# EAGLE design C64-usb-loader (EAGLE 6.5.0)
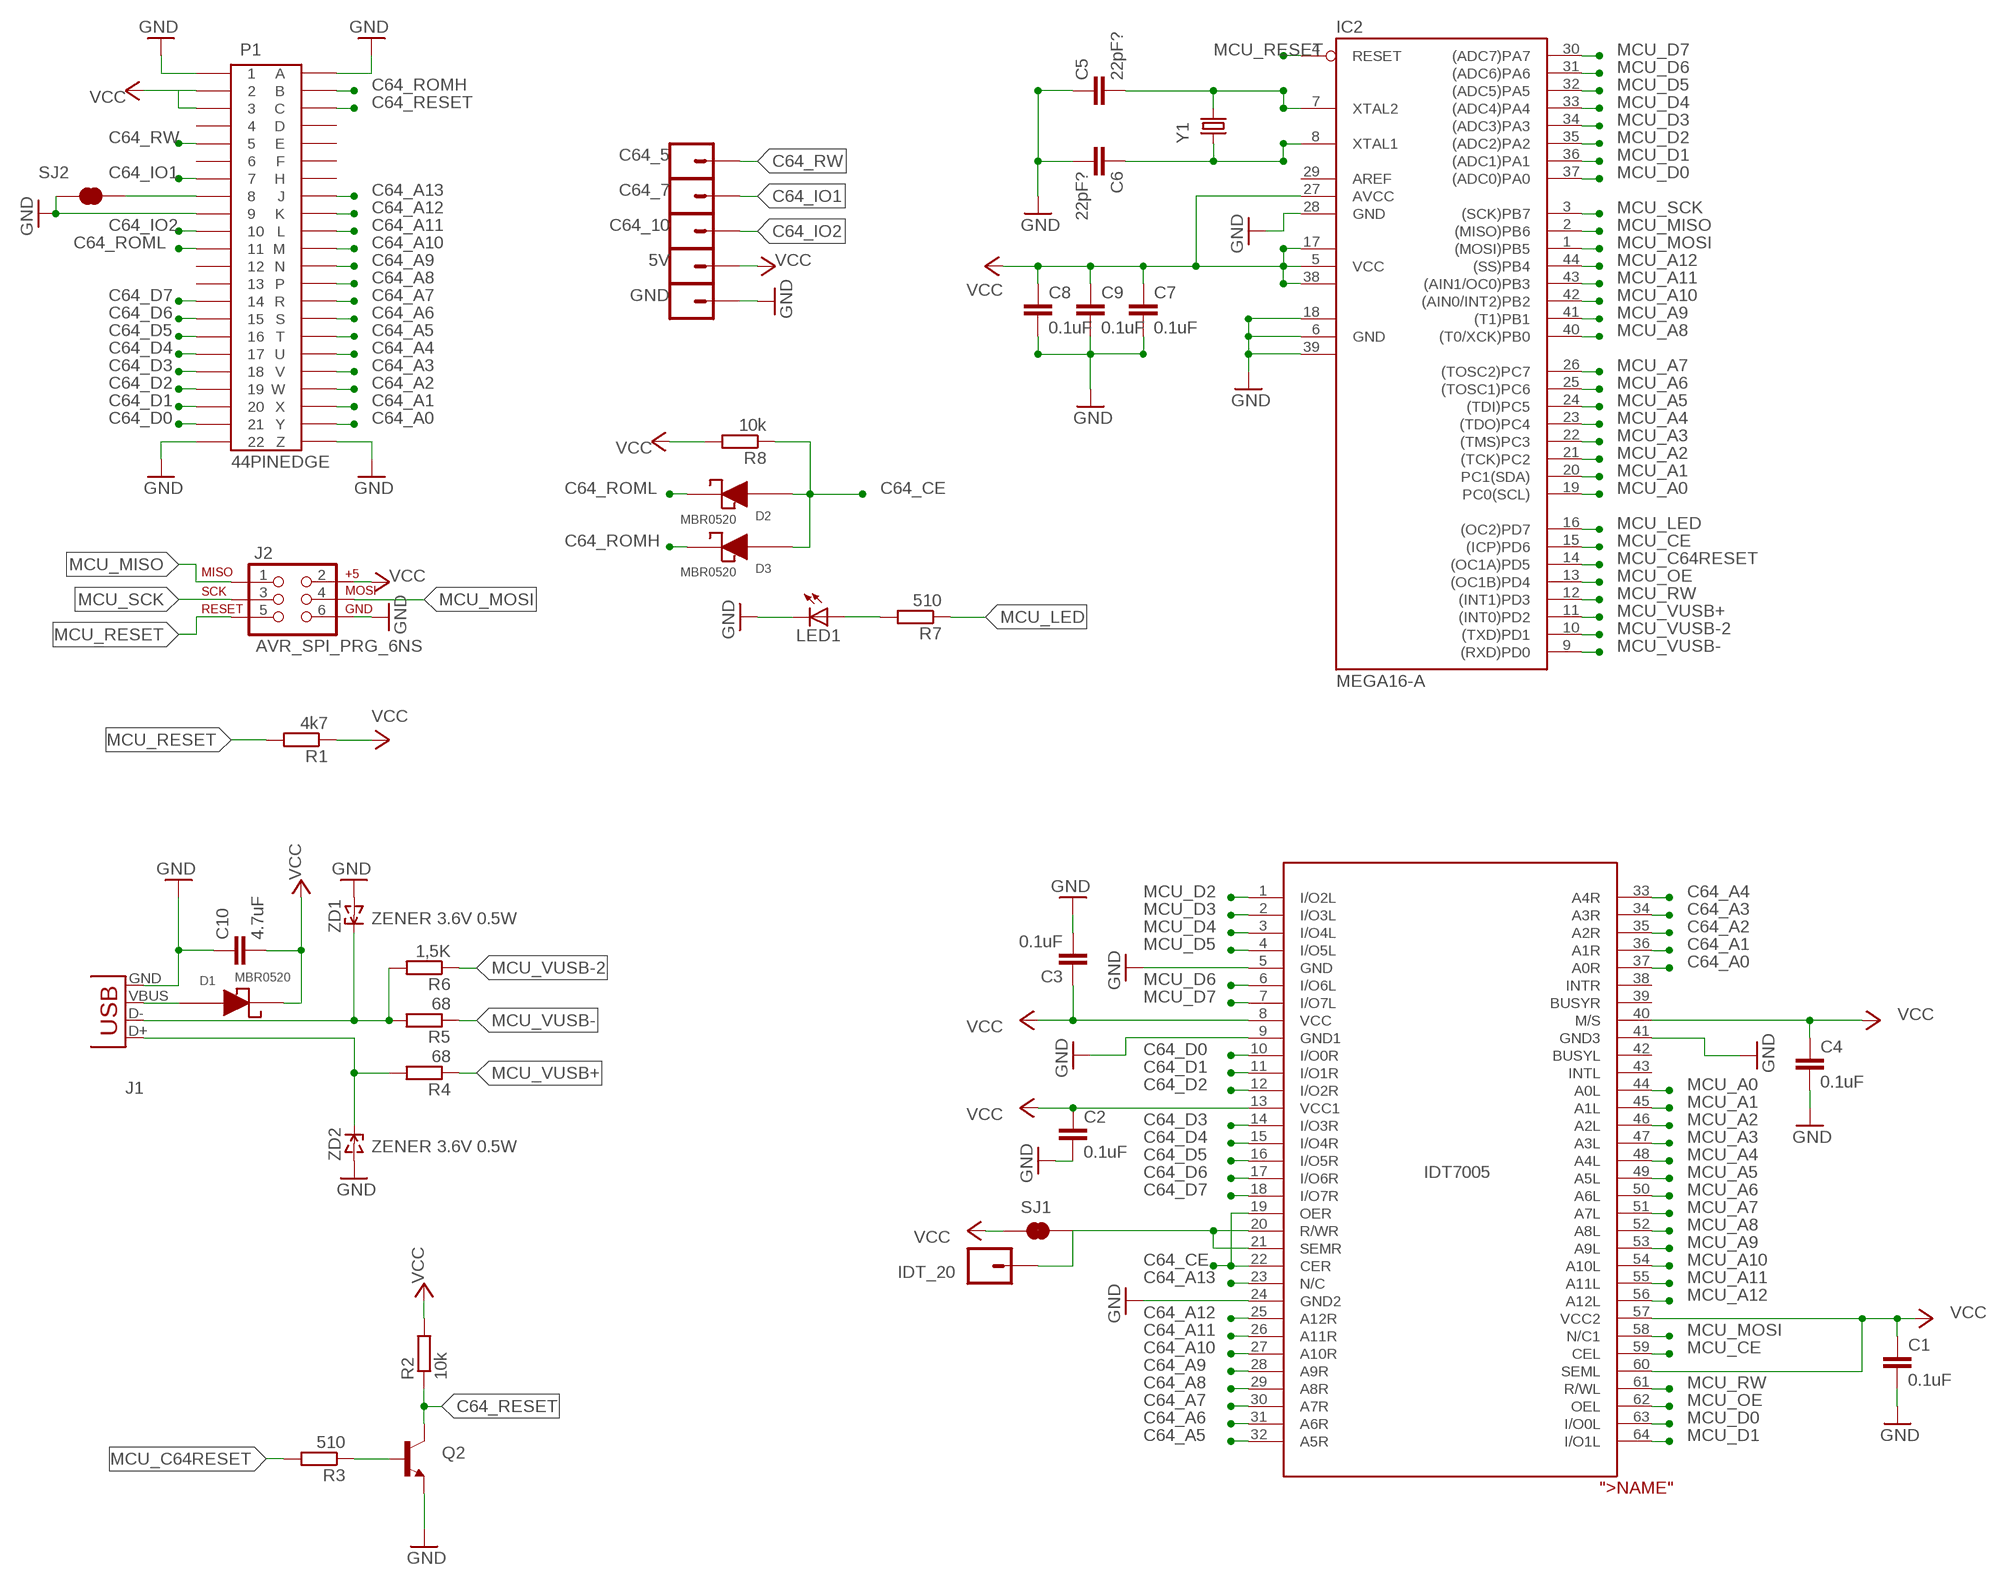
[diagram p0: schematic, sheet 1]

## Parts
5V  M01PTH  [1X01]
C1  0.1uF  C-EUC0805  [C0805]
C2  0.1uF  C-EUC0805  [C0805]
C3  0.1uF  C-EUC0805  [C0805]
C4  0.1uF  C-EUC0805  [C0805]
C5  22pF?  C-EUC0805  [C0805]
C6  22pF?  C-EUC0805  [C0805]
C7  0.1uF  C-EUC0805  [C0805]
C8  0.1uF  C-EUC0805  [C0805]
C9  0.1uF  C-EUC0805  [C0805]
C10  4.7uF  C-EUC0805  [C0805]
C64_5  M01PTH  [1X01]
C64_7  M01PTH  [1X01]
C64_10  M01PTH  [1X01]
D1  MBR0520  [SOD-123]
D2  MBR0520  [SOD-123]
D3  MBR0520  [SOD-123]
GND  M01PTH  [1X01]
IC1  IDT7005  [TQFP64]
IC2  MEGA16-A  [TQFP44]
IDT_20  M01PTH  [1X01]
J1  USB-B  [B]
J2  AVR_SPI_PRG_6NS  [2X3-NS]
LED1  LED1206  [LED-1206]
P1  44PINEDGE  [44PINEDGE]
Q2  TRANSISTOR_NPNSOT23-3  [SOT23-3]
R1  4k7  R-EU_M0805  [M0805]
R2  10k  R-EU_M0805  [M0805]
R3  510  R-EU_M0805  [M0805]
R4  68  R-EU_M0805  [M0805]
R5  68  R-EU_M0805  [M0805]
R6  1,5K  R-EU_M0805  [M0805]
R7  510  R-EU_M0805  [M0805]
R8  10k  R-EU_M0805  [M0805]
SJ1  JUMPER-PAD-2-NC_BY_TRACE  [PAD-JUMPER-2-NC_BY_TRACE_YES_SILK]
SJ2  JUMPER-PAD-2-NC_BY_TRACE  [PAD-JUMPER-2-NC_BY_TRACE_YES_SILK]
Y1  CRYSTALHC49US  [HC49US]
ZD1  ZENER 3.6V 0.5W  ZENERSOD-123  [SOD-123]
ZD2  ZENER 3.6V 0.5W  ZENERSOD-123  [SOD-123]

## Nets
C64_A0: IC1.37(A0R) P1.Y
C64_A1: IC1.36(A1R) P1.X
C64_A2: IC1.35(A2R) P1.W
C64_A3: IC1.34(A3R) P1.V
C64_A4: IC1.33(A4R) P1.U
C64_A5: IC1.32(A5R) P1.T
C64_A6: IC1.31(A6R) P1.S
C64_A7: IC1.30(A7R) P1.R
C64_A8: IC1.29(A8R) P1.P
C64_A9: IC1.28(A9R) P1.N
C64_A10: IC1.27(A10R) P1.M
C64_A11: IC1.26(A11R) P1.L
C64_A12: IC1.25(A12R) P1.K
C64_A13: IC1.23(N/C) P1.J
C64_CE: D2.2(AN) D3.2(AN) IC1.19(OER) IC1.22(CER) R8.1
C64_D0: IC1.10(I/O0R) P1.21
C64_D1: IC1.11(I/O1R) P1.20
C64_D2: IC1.12(I/O2R) P1.19
C64_D3: IC1.14(I/O3R) P1.18
C64_D4: IC1.15(I/O4R) P1.17
C64_D5: IC1.16(I/O5R) P1.16
C64_D6: IC1.17(I/O6R) P1.15
C64_D7: IC1.18(I/O7R) P1.14
C64_GAME: P1.8 SJ2.2
C64_IO1: C64_7.1 P1.7
C64_IO2: C64_10.1 P1.10
C64_RESET: P1.C Q2.3(C) R2.1
C64_ROMH: D3.1(CA) P1.B
C64_ROML: D2.1(CA) P1.11
C64_RW: C64_5.1 P1.5
D+: J1.D+ R4.2 ZD2.C
D-: J1.D- R5.2 R6.2 ZD1.C
GND: C1.2 C2.2 C3.2 C4.2 C5.1 C6.2 C7.2 C8.2 C9.2 C10.1 GND.1 IC1.5(GND) IC1.9(GND1) IC1.24(GND2) IC1.41(GND3) IC2.6(GND) IC2.18(GND1) IC2.28(GND) IC2.39(GND2) J1.GND J2.6 LED1.C P1.1 P1.9 P1.22 P1.A P1.Z Q2.2(E) SJ2.1 ZD1.A ZD2.A
MCU_A0: IC1.44(A0L) IC2.19(PC0(SCL))
MCU_A1: IC1.45(A1L) IC2.20(PC1(SDA))
MCU_A2: IC1.46(A2L) IC2.21((TCK)PC2)
MCU_A3: IC1.47(A3L) IC2.22((TMS)PC3)
MCU_A4: IC1.48(A4L) IC2.23((TDO)PC4)
MCU_A5: IC1.49(A5L) IC2.24((TDI)PC5)
MCU_A6: IC1.50(A6L) IC2.25((TOSC1)PC6)
MCU_A7: IC1.51(A7L) IC2.26((TOSC2)PC7)
MCU_A8: IC1.52(A8L) IC2.40((T0/XCK)PB0)
MCU_A9: IC1.53(A9L) IC2.41((T1)PB1)
MCU_A10: IC1.54(A10L) IC2.42((AIN0/INT2)PB2)
MCU_A11: IC1.55(A11L) IC2.43((AIN1/OC0)PB3)
MCU_A12: IC1.56(A12L) IC2.44((SS)PB4)
MCU_C64RESET: IC2.14((OC1A)PD5) R3.2
MCU_CE: IC1.59(CEL) IC2.15((ICP)PD6)
MCU_D0: IC1.63(I/O0L) IC2.37((ADC0)PA0)
MCU_D1: IC1.64(I/O1L) IC2.36((ADC1)PA1)
MCU_D2: IC1.1(I/O2L) IC2.35((ADC2)PA2)
MCU_D3: IC1.2(I/O3L) IC2.34((ADC3)PA3)
MCU_D4: IC1.3(I/O4L) IC2.33((ADC4)PA4)
MCU_D5: IC1.4(I/O5L) IC2.32((ADC5)PA5)
MCU_D6: IC1.6(I/O6L) IC2.31((ADC6)PA6)
MCU_D7: IC1.7(I/O7L) IC2.30((ADC7)PA7)
MCU_LED: IC2.16((OC2)PD7) R7.1
MCU_MISO: IC2.2((MISO)PB6) J2.1
MCU_MOSI: IC1.58(N/C1) IC2.1((MOSI)PB5) J2.4
MCU_OE: IC1.62(OEL) IC2.13((OC1B)PD4)
MCU_RESET: IC2.4(RESET) J2.5 R1.2
MCU_RW: IC1.61(R/WL) IC2.12((INT1)PD3)
MCU_SCK: IC2.3((SCK)PB7) J2.3
MCU_VUSB+: IC2.11((INT0)PD2) R4.1
MCU_VUSB-: IC2.9((RXD)PD0) R5.1
MCU_VUSB-2: IC2.10((TXD)PD1) R6.1
N$1: Q2.1(B) R3.1
N$3: C5.2 IC2.7(XTAL2) Y1.2
N$4: IC1.20(R/WR) IC1.21(SEMR) IDT_20.1 SJ1.2
N$5: C6.1 IC2.8(XTAL1) Y1.1
N$8: LED1.A R7.2
VBUS: D1.2(AN) J1.VBUS
VCC: 5V.1 C1.1 C2.1 C3.1 C4.1 C7.1 C8.1 C9.1 C10.2 D1.1(CA) IC1.8(VCC) IC1.13(VCC1) IC1.40(M/S) IC1.57(VCC2) IC1.60(SEML) IC2.5(VCC) IC2.17(VCC1) IC2.27(AVCC) IC2.38(VCC2) J2.2 P1.2 P1.3 R1.1 R2.2 R8.2 SJ1.1
Unconnected: IC1.38(INTR) IC1.39(BUSYR) IC1.42(BUSYL) IC1.43(INTL) IC2.29(AREF) P1.4 P1.6 P1.12 P1.13 P1.D P1.E P1.F P1.H

## Library data of the parts
5V C64_5 C64_7 C64_10 GND IDT_20 = SparkFun-Connectors:M01: Header 1 Standard 1-pin 0.1" header. Use with straight break away headers (SKU : PRT-00116), right angle break away headers (PRT-00553), swiss pins (PRT-00743), machine pins (PRT-00117), and female headers (PRT-00115).
C1-C10 = rcl:C-EU: CAPACITOR, European symbol
D1-D3 = Arduino Nano2:MBR0520; DIGIKEY: MBR0520LCT-ND
IC1 = IDT7005:IDT7005; DIGIKEY: 800-1357-5-ND ??
IC2 = atmel:MEGA16: MICROCONTROLLER 16 Kbytes FLASH 1 kbytes SRAM 512 bytes EEPROM USART 8-channel 10 bit ADC Source: avr.lbr; DIGIKEY: ATMEGA16A-AURCT-ND ??; MPN: ATMEGA16-16AU; OC_FARNELL: 9171134; OC_NEWARK: 96K6515
J1 = Connector:USB: USB Connectors USB-B-PTH is fully proven SKU : PRT-00139 USB-miniB is fully proven SKU : PRT-00587 USB-A-PCB is untested. USB-A-H is throughly reviewed, but untested. Spark Fun Electronics SKU : PRT-00437 USB-B-SMT is throughly reviewed, but untested. Needs silkscreen touching up. USB-A-S has not been used/tested USB-MB-H has not been used/tested; DIGIKEY: ED2983-ND ??
J2 = SparkFun-Connectors:AVR_SPI_PRG_6: AVR ISP 6 Pin This is the reduced ISP connector for AVR programming. Common on Arduino. This footprint will take up less PCB space and can be used with a 10-pin to 6-pin adapter such as SKU: BOB-08508
LED1 = SparkFun-LED:LED: LEDs Standard schematic elements and footprints for 5mm, 3mm, 1206, and 0603 sized LEDs. 5mm - Spark Fun Electronics SKU : COM-00529 (and others)
P1 = commodore1:44PINEDGE: 44 PIN EDGE CONNECTOR FOR PCB
Q2 = SparkFun-DiscreteSemi:TRANSISTOR_NPN: Generic NPN BJT. MMBT2222 is the common NPN we use. Double check against datasheet- not all devices are the same!; DIGIKEY: MMBT2222A-FDICT-ND
R1 R2 R4-R8 = rcl:R-EU_: RESISTOR, European symbol
R3 = rcl:R-EU_: RESISTOR, European symbol; ORIGVALUE: 10k
SJ1 SJ2 = SparkFun-Passives:JUMPER-PAD-2-NC_BY_TRACE
Y1 = SparkFun-FreqCtrl:CRYSTAL: Various standard crystals. Proven footprints. Spark Fun Electronics SKU : COM-00534
ZD1 ZD2 = dp_devices:ZENER: Zener Diode SOD-323; DIGIKEY: MMSZ5227B-FDICT-ND ??

## Board
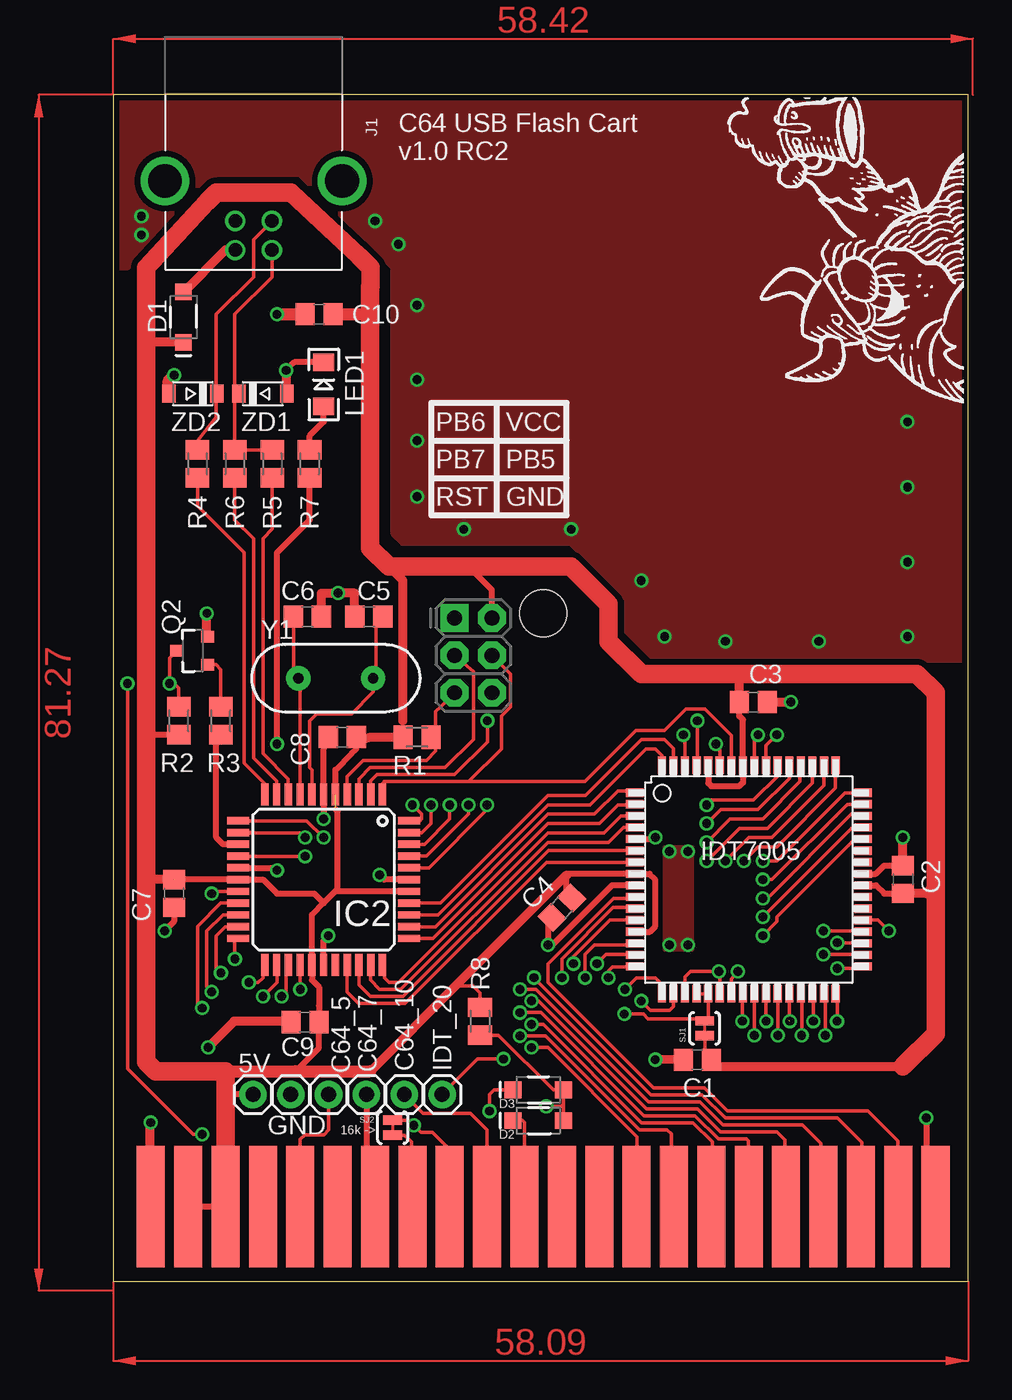
[diagram p1: board, top side]
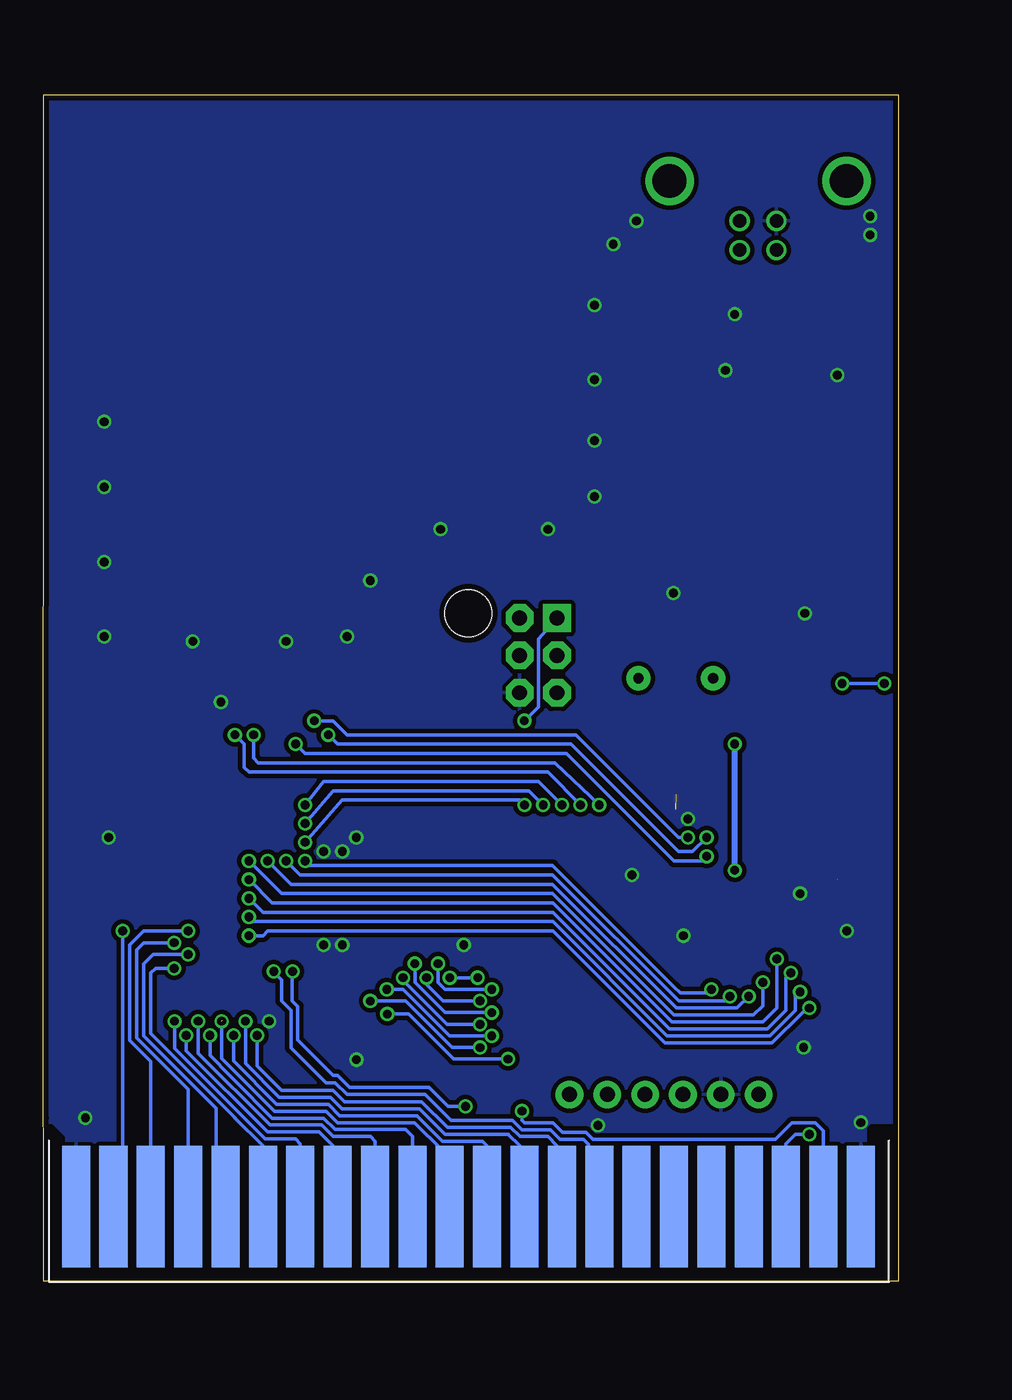
[diagram p2: board, bottom side, seen from below]

Size 58.1 x 80.64 mm. Coordinates in mm from the lower left corner, seen from the top.
Outline: 0,0 58.09,0 58.09,9.83 58.1,11.11 58.09,80.64 0,80.64 0,0
Copper layers (1*16): Top 0.0356mm / dielectric 1.5011mm / Bottom 0.0356mm
Design rules "OSHPark - LaenPCBOrder": minimum track width 6mil, minimum drill 13mil, track to track 6mil, track to pad 6mil, pad to pad 6mil, via to via 6mil, smd to smd 6mil, copper to edge 15mil, drill to drill 6mil, minimum pad ring 7mil, minimum via ring 7mil, stop-mask expansion 4mil, vias tented up to drill 0mil, thermal gap 10mil
Holes 3.2 mm at 29.21,45.4

### Footprints (pad centres in the part's own frame; a part is rotated, then mirrored left to right if it is on the bottom)
1X01 = drill 1.016 pad 1.88: 1 0,0
C0805 = smd 1.3 x 1.5: 1 -0.95,0; 2 0.95,0
SOD-123 = smd 1.143 x 1.143: 1 0,0; 2 3.429,0
TQFP64 = smd 1.194 x 0.559: 1 -7.76,5.905; 2 -7.76,5.118; 3 -7.76,4.331; 4 -7.76,3.543; 5 -7.76,2.756; 6 -7.76,1.968; 7 -7.76,1.181; 8 -7.76,0.394; 9 -7.76,-0.394; 10 -7.76,-1.181; 11 -7.76,-1.968; 12 -7.76,-2.756; 13 -7.76,-3.543; 14 -7.76,-4.331; 15 -7.76,-5.118; 16 -7.76,-5.905; 33 7.76,-5.905; 34 7.76,-5.118; 35 7.76,-4.331; 36 7.76,-3.543; 37 7.76,-2.756; 38 7.76,-1.968; 39 7.76,-1.181; 40 7.76,-0.394; 41 7.76,0.394; 42 7.76,1.181; 43 7.76,1.968; 44 7.76,2.756; 45 7.76,3.543; 46 7.76,4.331; 47 7.76,5.118; 48 7.76,5.905 | smd 0.559 x 1.194: 17 -5.905,-7.76; 18 -5.118,-7.76; 19 -4.331,-7.76; 20 -3.543,-7.76; 21 -2.756,-7.76; 22 -1.968,-7.76; 23 -1.181,-7.76; 24 -0.394,-7.76; 25 0.394,-7.76; 26 1.181,-7.76; 27 1.968,-7.76; 28 2.756,-7.76; 29 3.543,-7.76; 30 4.331,-7.76; 31 5.118,-7.76; 32 5.905,-7.76; 49 5.905,7.76; 50 5.118,7.76; 51 4.331,7.76; 52 3.543,7.76; 53 2.756,7.76; 54 1.968,7.76; 55 1.181,7.76; 56 0.394,7.76; 57 -0.394,7.76; 58 -1.181,7.76; 59 -1.968,7.76; 60 -2.756,7.76; 61 -3.543,7.76; 62 -4.331,7.76; 63 -5.118,7.76; 64 -5.905,7.76
TQFP44 = smd 1.5 x 0.5: 1 -5.8,4; 2 -5.8,3.2; 3 -5.8,2.4; 4 -5.8,1.6; 5 -5.8,0.8; 6 -5.8,0; 7 -5.8,-0.8; 8 -5.8,-1.6; 9 -5.8,-2.4; 10 -5.8,-3.2; 11 -5.8,-4; 23 5.8,-4; 24 5.8,-3.2; 25 5.8,-2.4; 26 5.8,-1.6; 27 5.8,-0.8; 28 5.8,0; 29 5.8,0.8; 30 5.8,1.6; 31 5.8,2.4; 32 5.8,3.2; 33 5.8,4 | smd 0.5 x 1.5: 12 -4,-5.8; 13 -3.2,-5.8; 14 -2.4,-5.8; 15 -1.6,-5.8; 16 -0.8,-5.8; 17 0,-5.8; 18 0.8,-5.8; 19 1.6,-5.8; 20 2.4,-5.8; 21 3.2,-5.8; 22 4,-5.8; 34 4,5.8; 35 3.2,5.8; 36 2.4,5.8; 37 1.6,5.8; 38 0.8,5.8; 39 0,5.8; 40 -0.8,5.8; 41 -1.6,5.8; 42 -2.4,5.8; 43 -3.2,5.8; 44 -4,5.8
B = drill 0.914: D+ 0,1.25; D- 1.981,1.25; GND 0,-1.25; VBUS 1.981,-1.25 | drill 2.286: P$1 -2.718,-6.02; P$2 -2.718,6.02
2X3-NS = drill 1.016 pad 1.88 square: 1 -2.54,-1.27 | drill 1.016 pad 1.88 octagon: 2 -2.54,1.27; 3 0,-1.27; 4 0,1.27; 5 2.54,-1.27; 6 2.54,1.27
LED-1206 = smd 1.2 x 1.4: A -1.5,0; C 1.5,0
44PINEDGE = smd 1.905 x 8.255: 1 0,3.81; 2 2.54,3.81; 3 5.08,3.81; 4 7.62,3.81; 5 10.16,3.81; 6 12.7,3.81; 7 15.24,3.81; 8 17.78,3.81; 9 20.32,3.81; 10 22.86,3.81; 11 25.4,3.81; 12 27.94,3.81; 13 30.48,3.81; 14 33.02,3.81; 15 35.56,3.81; 16 38.1,3.81; 17 40.64,3.81; 18 43.18,3.81; 19 45.72,3.81; 20 48.26,3.81; 21 50.8,3.81; 22 53.34,3.81 | smd 1.905 x 8.255 bottom: A 0,3.81; B 2.54,3.81; C 5.08,3.81; D 7.62,3.81; E 10.16,3.81; F 12.7,3.81; H 15.24,3.81; J 17.78,3.81; K 20.32,3.81; L 22.86,3.81; M 25.4,3.81; N 27.94,3.81; P 30.48,3.81; R 33.02,3.81; S 35.56,3.81; T 38.1,3.81; U 40.64,3.81; V 43.18,3.81; W 45.72,3.81; X 48.26,3.81; Y 50.8,3.81; Z 53.34,3.81
SOT23-3 = smd 0.8 x 0.9: 1 -0.95,-1; 2 0.95,-1; 3 0,1.1
M0805 = smd 1.3 x 1.6: 1 -0.95,0; 2 0.95,0
PAD-JUMPER-2-NC_BY_TRACE_YES_SILK = smd 0.635 x 1.27: 1 -0.508,0; 2 0.508,0
HC49US = drill 0.7 pad 1.651: 1 -2.54,0; 2 2.54,0
SOD-123' = smd 0.91 x 1.22: A 1.635,0; C -1.635,0

### Placement (x,y rotation side)
5V  9.48,12.7 0 top
C1  39.69,15.07 180 top
C2  53.66,27.3 90 top
C3  43.5,39.37 0 top
C4  30.48,25.4 225 top
C5  17.36,45.17 0 top
C6  13.18,45.17 0 top
C7  4.13,26.35 270 top
C8  15.56,36.99 180 top
C9  13.02,17.62 180 top
C10  13.97,65.72 0 top
C64_5  14.63,12.7 0 top
C64_7  17.2,12.7 0 top
C64_10  19.77,12.7 0 top
D1  4.76,63.82 90 top
D2  27.17,10.93 0 top
D3  27.17,13.02 0 top
GND  12.06,12.7 0 top
IC1  43.18,27.3 0 top
IC2  14.29,27.3 270 top
IDT_20  22.34,12.7 0 top
J1  9.53,72.07 270 top
J2  24.46,42.55 270 top
LED1  14.29,60.96 90 top
P1  2.54,1.27 0 top
Q2  5.4,42.86 90 top
R1  20.64,36.98 0 top
R2  4.45,38.1 270 top
R3  7.3,38.1 270 top
R4  5.71,55.56 90 top
R5  10.79,55.56 90 top
R6  8.26,55.56 90 top
R7  13.34,55.56 90 top
R8  24.92,17.68 90 top
SJ1  40.19,17.2 90 top
SJ2  18.97,10.45 270 top
U$1  [HAREK_20X16MM]  57.78,59.69 90 top
Y1  15.11,40.99 0 top
ZD1  ZENER 3.6V 0.5W  [SOD-123']  10.16,60.33 0 top
ZD2  ZENER 3.6V 0.5W  [SOD-123']  5.4,60.33 180 top

### Tracks (layer width: path | path; a pad name or v marks a point on that pad's centre or on a via)
C64_A0  (via drill 0.6)
  Top 0.254: IC1.37 51.96,24.55 v52.7,23.81
  Bottom 0.254: v52.7,23.81 52.7,5.72 P1.Y
C64_A1  (via drill 0.6)
  Top 0.254: v48.26,23.81 50.89,23.81 IC1.36
  Bottom 0.254: P1.X 50.8,14.95 52.22,16.38 52.22,22.86 51.27,23.81 49.85,23.81 49.53,23.81 v48.26,23.81
C64_A2  (via drill 0.6)
  Top 0.254: v49.21,23.02 50.9,23.02 IC1.35
  Bottom 0.254: P1.W 48.26,13.05 51.75,16.53 51.75,22.54 51.27,23.02 v49.21,23.02
C64_A3  (via drill 0.6)
  Top 0.254: v48.26,22.23 50.9,22.23 IC1.34
  Bottom 0.254: P1.V 46.35,9.21 46.35,11.77 51.27,16.69 51.27,21.59 50.64,22.23 v48.26,22.23
C64_A4  (via drill 0.6)
  Top 0.254: v49.21,21.27 50.81,21.27 IC1.33
  Bottom 0.254: P1.U 43.18,9.21 45.09,11.11 45.06,11.11 50.8,16.85 50.8,20.95 50.48,21.27 v49.21,21.27
C64_A5  (via drill 0.6)
  Top 0.254: v49.19,17.68 49.19,19.44 IC1.32
  Bottom 0.254: P1.T 40.64,9.36 40.96,9.67 43.02,9.67 49.19,15.85 v49.19,17.68
C64_A6  (via drill 0.6)
  Top 0.254: 48.41,19.43 IC1.31 48.39,19.46 v48.39,16.72
  Bottom 0.254: P1.S 38.1,8.89 39.36,10.15 42.86,10.15 48.39,15.68 v48.39,16.72
C64_A7  (via drill 0.6)
  Top 0.254: v47.58,17.68 47.58,19.47 IC1.30
  Bottom 0.254: P1.R 35.56,9.53 35.88,9.84 38.42,9.84 39.2,10.62 42.7,10.62 47.58,15.5 v47.58,17.68
C64_A8  (via drill 0.6)
  Top 0.254: v46.78,16.72 46.78,19.49 IC1.29
  Bottom 0.254: P1.P 33.02,9.84 33.49,10.32 38.27,10.32 39.04,11.1 42.55,11.1 45.1,13.65 45.4,13.97 46.78,15.35 v46.78,16.72
C64_A9  (via drill 0.6)  (1 unrouted)
  Top 0.254: 45.94,17.73 IC1.28
  Bottom 0.254: P1.N 30.8,5.73 30.96,8.89 32.86,10.79 38.11,10.79 38.89,11.57 42.39,11.57 45.97,15.16 v45.97,17.68
C64_A10  (via drill 0.6)
  Top 0.254: v45.17,16.72 45.17,19.52 IC1.27
  Bottom 0.254: P1.M 27.94,9.2 28.26,9.52 30.96,9.52 32.7,11.27 37.95,11.27 38.73,12.04 42.23,12.04 45.17,14.98 v45.17,16.72
C64_A11  (via drill 0.6)
  Top 0.254: IC1.26 v44.36,17.69 v44.37,17.68
  Bottom 0.254: P1.L 25.72,9.21 26.51,10 26.5,10 29.87,9.99 30.8,9.99 32.55,11.74 37.79,11.74 38.57,12.52 42.08,12.52 44.37,14.81 v44.37,17.68
C64_A12  (via drill 0.6)
  Top 0.254: 43.5,19.47 IC1.25 43.56,19.54 v43.56,16.72
  Bottom 0.254: P1.K 23.18,5.5 23.18,9.21 23.81,9.84 25.72,9.84 26.35,10.48 27.95,10.48 27.94,10.47 30.64,10.47 32.39,12.21 37.64,12.21 38.42,12.99 41.92,12.99 43.56,14.64 v43.56,16.72
C64_A13  (via drill 0.6)
  Top 0.254: IC1.23 42,20.57 v42.44,21.06
  Bottom 0.254: v42.44,21.06 41.91,20.48 41.91,19.05 41.27,18.41 41.27,15.88 38.9,13.5 38.26,13.5 37.45,12.7 32.15,12.7 30.38,10.93 26.2,10.93 25.56,10.29 23.63,10.29 22.99,9.64 21.38,9.64 21.06,9.32 20.58,5.34 P1.J
C64_CE  (via drill 0.6)
  Top 0.254: IC1.19 38.85,20.68 39.22,21.06 v41.15,21.06 41.21,21 IC1.22 | R8.1 26.19,16.73 29.9,13.02 D3.2 30.6,12.06 | 30.6,12.06 D2.2 | v29.42,11.9 30.43,11.9 30.6,12.06
  Bottom 0.254: v41.15,21.06 41.21,21 41.21,19.06 40.83,18.68 40.83,16.4 38.42,13.98 38.1,13.98 37.29,13.18 31.88,13.18 30.6,11.9 v29.42,11.9
C64_D0
  Top 0.254: P1.21 53.33,9.54 51.29,11.58 41.74,11.58 40.16,13.16 36.69,13.16 29.53,20.32 29.53,21.59 33.97,26.04 35.33,26.04 IC1.10
C64_D1  (via drill 0.6)
  Top 0.254: P1.20 50.87,5.14 50.87,9.46 49.22,11.1 41.58,11.1 40.01,12.68 36.53,12.68 v28.57,20.64 v28.58,20.64 | v30.48,20.64 30.48,21.91 33.97,25.4 35.36,25.4 IC1.11
  Bottom 0.254: v30.48,20.64 30,20.64 v28.58,20.64
C64_D2  (via drill 0.6)
  Top 0.254: P1.19 48.26,6.35 48.09,6.52 48.09,9.38 46.84,10.63 41.43,10.63 39.85,12.21 36.38,12.21 28.74,19.85 v27.63,19.85 | v31.27,21.59 31.27,22.07 33.75,24.55 IC1.12
  Bottom 0.254: v31.27,21.59 31.27,20.32 30.8,19.85 v27.63,19.85
C64_D3  (via drill 0.6)
  Top 0.254: P1.18 45.72,6.35 45.62,6.45 45.62,9.62 45.09,10.16 41.27,10.16 39.69,11.74 36.22,11.74 28.9,19.06 v28.42,19.06 | v32.06,20.64 32.06,22.23 32.69,22.86 35.31,22.86 IC1.14
  Bottom 0.254: v28.42,19.06 30.95,19.06 32.06,20.17 v32.06,20.64
C64_D4  (via drill 0.6)
  Top 0.254: P1.17 43.16,9.54 43.02,9.68 41.11,9.68 39.53,11.26 36.06,11.26 29.06,18.27 v27.63,18.27 | v32.85,21.59 33.49,22.23 35.38,22.23 IC1.15
  Bottom 0.254: v32.85,21.59 32.85,20.32 30.8,18.27 v27.63,18.27
C64_D5  (via drill 0.6)
  Top 0.254: P1.16 40.64,6.67 40.7,6.61 40.7,9.47 39.38,10.79 35.91,10.79 29.22,17.47 v28.42,17.47 | 35.29,21.27 IC1.16 35.4,21.38 33.92,21.38 33.65,21.11 v33.65,20.64
  Bottom 0.254: v33.65,20.64 33.65,20.46 30.66,17.47 v28.42,17.47
C64_D6  (via drill 0.6)
  Top 0.254: P1.15 38.1,5.71 37.92,5.9 37.92,10.02 37.63,10.31 35.75,10.31 29.38,16.68 v27.63,16.68 | IC1.17 37.15,19.42 37.15,20.32 36.83,20.64 35.56,20.64 v34.76,19.84
  Bottom 0.254: v27.63,16.68 30.48,16.68 33.64,19.84 v34.76,19.84
C64_D7  (via drill 0.6)
  Top 0.254: 35.46,5.18 P1.14 35.59,5.11 35.59,9.84 29.54,15.89 v28.42,15.89 | v35.88,19.05 36.51,18.41 37.78,18.41 38.06,18.69 IC1.18
  Bottom 0.254: v35.88,19.05 33.48,19.05 30.32,15.89 v28.42,15.89
C64_GAME
  Top 0.254: SJ2.2 19.8,9.94 20.25,9.48 20.25,5.15 P1.8
C64_IO1
  Top 0.406: C64_7.1 17.2,8.84 17.14,8.56 17.14,8.89 P1.7
C64_IO2
  Top 0.254: C64_10.1 21.06,11.41 24.27,11.41 25.4,10.29 P1.10
C64_RESET  (via drill 0.6)
  Top 0.254: R2.1 4.45,40.32 4.13,40.64 v3.81,40.64 3.81,42.38 Q2.3 | v0.95,40.64 0.95,14.46 5.41,9.99 v6.03,9.99
  Bottom 0.254: v3.81,40.64 v0.95,40.64 | v6.03,9.99 6.99,9.99 7.62,9.36 P1.C
C64_ROMH  (via drill 0.6)
  Top 0.254: v25.56,11.57 25.56,12.7 25.88,13.02 D3.1
  Bottom 0.254: P1.B 5.08,10.22 5.63,10.77 7.23,10.77 8.36,9.64 20.74,9.64 21.22,10.13 22.83,10.13 23.47,10.77 25.4,10.77 25.56,10.93 v25.56,11.57
C64_ROML
  Top 0.254: P1.11 27.94,10.8 27.81,10.93 D2.1
C64_RW
  Top 0.254: P1.5 12.7,9.65 13.02,9.97 14.31,9.97 14.63,10.29 C64_5.1
D+
  Top 0.254: R4.2 5.71,57.15 6.99,58.74 6.99,59.96 ZD2.C 6.99,60.05 6.99,65.72 9.53,68.26 9.53,70.8 10.78,72.05 J1.D+
D-
  Top 0.254: 8.26,60.28 8.26,65.72 10.78,68.24 J1.D- | 8.26,60.28 ZD1.C | 8.26,60.28 R6.2 R5.2
GND  (via drill 0.6, 0.6 pad 0.25)
  Top 0.254: 42.86,19.62 IC1.24 | IC2.18 6.83,26.5 v6.67,26.35 | 42.71,19.47 IC1.24 | v42.76,17.68 42.76,19.52 IC1.24 | P1.9 22.86,8.97 21.7,10.13 20.9,10.13 v20.41,10.61 20.09,10.93 18.99,10.93 SJ2.1
  Top 0.305: C2.2
  Top 0.406: IC2.28 14.29,23.18 v14.61,23.5 | IC2.39 18.41,27.3 v18.1,27.62 | v14.29,31.43 IC2.6 14.29,36.19 C8.2 | IC1.9 33.9,26.91 29.84,22.86 v29.53,22.86 29.53,24.45 29.56,24.41 29.84,24.41 C4.2 | IC1.41 51.83,27.7 52.39,28.26 C2.2 | C7.2 4.13,24.45 v3.49,23.81 | LED1.C 12.29,62.46 v11.75,61.91 | v55.24,11.11 55.24,5.55 P1.Z | IC1.5 36.73,30.06 v36.83,30.16
  Top 0.61: C2.2 v53.66,30.16 | C6.2 14.15,46.78 v15.27,46.78 16.4,46.78 C5.1 | v11.75,61.91 11.75,60.69 ZD1.A | C3.2 v46.04,39.37 | P1.A 2.49,10.75 v2.54,10.79 | C9.2 12.06,17.62 12.06,17.68 8.2,17.68 v6.43,15.91 | C1.2 v36.83,15.07 | Q2.2 6.35,43.81 v6.35,45.4
  Top 0.813: ZD2.A 3.76,61.23 v4.13,61.59 | v11.11,65.72 C10.1
  other vias: 1.91,71.12 1.91,72.39 53.98,43.81 37.47,43.81 31.11,51.12 23.81,51.12 20.64,61.28 19.37,70.48 17.78,72.07 20.64,57.15 20.64,66.36 35.88,47.62 20.64,53.34 41.59,43.5 47.94,43.5 53.98,58.42 53.98,53.98 53.98,48.9 37.78,29.21 39.05,29.21 37.78,22.86 39.05,22.86
  pour Bottom (isolate 0.305): 0,80.64 58.1,80.64 58.1,10.79 57.47,10.79 56.52,9.84 56.52,9.21 2.22,9.21 2.22,10.48 1.91,10.79 0,10.79
  pour Top (isolate 0.406): 0,80.64 58.1,80.64 58.1,42.55 57.78,42.23 36.83,42.23 34.92,44.13 34.92,46.35 31.11,50.16 19.68,50.16 19.05,50.8 19.05,68.9 12.7,75.25 6.99,75.25 5.4,73.66 0.95,68.9 0,68.9
  pour Top: 37.47,29.53 39.37,29.53 39.37,22.54 37.47,22.54
MCU_A0  (via drill 0.6)
  Top 0.254: IC1.44 50.38,30.06 45.09,24.77 45.09,24.45 v44.13,23.5 | 8.47,25.72 IC2.19 7.29,25.7 5.71,24.13 5.71,18.73 v6.03,18.58
  Bottom 0.254: v44.13,23.5 43.18,23.5 42.86,23.81 23.47,23.81 15.86,16.2 8.57,16.2 6.51,18.26 6.19,18.58 v6.03,18.58
MCU_A1  (via drill 0.6)
  Top 0.254: IC1.45 50.89,30.8 50.16,30.8 v44.13,24.77 | v6.67,19.68 6.35,20 6.35,23.81 7.44,24.91 IC2.20
  Bottom 0.254: v44.13,24.77 43.81,24.45 23.47,24.45 15.7,16.68 8.72,16.68 6.99,18.42 6.99,19.37 v6.67,19.68
MCU_A2  (via drill 0.6)
  Top 0.254: v44.13,26.04 44.45,26.04 50.16,31.75 50.83,31.75 IC1.46 | v7.3,20.95 6.99,21.27 6.99,23.5 7.59,24.11 IC2.21
  Bottom 0.254: v44.13,26.04 43.18,25.08 23.48,25.08 15.55,17.15 8.88,17.15 7.62,18.41 7.62,20.64 v7.3,20.95
MCU_A3  (via drill 0.6)
  Top 0.254: IC1.47 49.89,32.42 44.77,27.3 v44.13,27.3 | 8.36,23.18 IC2.22 8.26,23.07 v8.26,21.91
  Bottom 0.254: v44.13,27.3 42.55,25.72 23.48,25.72 15.39,17.63 9.2,17.63 8.26,18.57 v8.26,21.91
MCU_A4  (via drill 0.6)
  Top 0.254: IC1.48 49.72,33.21 45.09,28.57 v44.13,28.57 | v9.21,20.32 9.84,20.32 10.16,20.64 10.16,21.38 IC2.23
  Bottom 0.254: v44.13,28.57 41.91,26.35 23.48,26.35 15.23,18.1 9.84,18.1 9.21,18.73 v9.21,20.32
MCU_A5  (via drill 0.6)
  Top 0.254: IC1.49 49.09,33.53 45.09,29.53 43.81,29.53 v42.86,28.57 | v10.16,19.37 11.11,20.32 11.11,21.48 IC2.24
  Bottom 0.254: v42.86,28.57 41.27,26.99 23.49,26.99 15.07,18.58 10.95,18.58 v10.16,19.37
MCU_A6  (via drill 0.6)
  Top 0.254: IC1.50 48.3,33.69 44.77,30.16 43.18,30.16 v41.59,28.57 | v11.43,19.37 11.75,19.68 11.75,21.36 IC2.25
  Bottom 0.254: v41.59,28.57 40.64,27.62 23.49,27.62 14.92,19.05 11.75,19.05 v11.43,19.37
MCU_A7  (via drill 0.6)
  Top 0.254: IC1.51 47.51,33.86 44.45,30.8 42.55,30.8 v40.32,28.57 | v12.7,19.84 IC2.26
  Bottom 0.254: v40.32,28.57 40.01,28.26 23.5,28.26 15.24,20 14.79,19.61 13.02,19.61 12.7,19.93 v12.7,19.84
MCU_A8  (via drill 0.6)
  Top 0.254: v40.32,29.84 41.91,31.43 44.13,31.43 46.67,33.97 46.67,35.01 IC1.52 | IC2.40 21.44,28.11 25.4,32.07 v25.4,32.38
  Bottom 0.254: v25.4,32.38 25.72,32.7 37.78,32.7 v40.32,29.84
MCU_A9  (via drill 0.6)
  Top 0.254: IC1.53 45.94,34.19 43.81,32.07 41.27,32.07 v40.32,31.11 | 20.1,28.89 IC2.41 21.29,28.91 24.13,31.75 v24.13,32.38
  Bottom 0.254: v40.32,31.11 38.42,33.34 25.08,33.34 v24.13,32.38
MCU_A10  (via drill 0.6)
  Top 0.254: IC1.54 45.15,34.35 43.5,32.7 40.64,32.7 v40.32,32.38 | IC2.42 21.13,29.7 22.86,31.43 v22.86,32.38
  Bottom 0.254: v40.32,32.38 39.05,33.97 24.45,33.97 v22.86,32.38
MCU_A11  (via drill 0.6)
  Top 0.254: IC2.43 20.11,30.48 20.95,30.48 21.59,31.11 v21.59,32.38 | IC1.55 44.36,36.42 v45.09,37.15
  Bottom 0.254: v21.59,32.38 23.81,34.61 44.13,34.61 44.45,34.92 44.45,36.51 v45.09,37.15
MCU_A12  (via drill 0.6)
  Top 0.254: IC1.56 43.57,36.91 v43.81,37.15 | IC2.44 20.83,31.3 20.95,31.43 20.95,31.75 v20.32,32.38
  Bottom 0.254: v43.81,37.15 43.81,35.56 43.5,35.24 23.33,35.24 v20.32,32.38
MCU_C64RESET
  Top 0.406: IC2.14 7.44,29.7 6.99,30.16 6.99,36.51 7.3,36.83 R3.2
MCU_CE  (via drill 0.6)
  Top 0.254: IC1.59 41.21,36.13 v40.96,36.51 | v13.02,28.89 8.5,28.89 IC2.15
  Bottom 0.254: v40.96,36.51 40.32,35.88 22.54,35.88 15.24,28.57 13.34,28.57 v13.02,28.89
MCU_D0
  Top 0.254: IC2.37 22.23,25.7 29.54,33.02 32.07,33.02 35.88,36.83 37.47,36.83 38.06,36.23 IC1.63
MCU_D1
  Top 0.254: IC2.36 22.06,24.91 29.54,32.38 32.38,32.38 36.2,36.2 36.83,36.2 37.27,35.75 IC1.64
MCU_D2
  Top 0.254: IC2.35 21.89,24.11 29.54,31.75 32.7,31.75 34.29,33.34 35.29,33.34 IC1.1
MCU_D3
  Top 0.254: IC2.34 21.72,23.3 29.53,31.11 33.02,31.11 34.29,32.38 35.38,32.38 IC1.2
MCU_D4
  Top 0.254: IC2.33 18.41,21.38 18.41,20.64 18.73,20.32 19.37,20.32 29.53,30.48 33.34,30.48 34.49,31.64 IC1.3
MCU_D5
  Top 0.254: IC2.32 17.46,21.48 17.46,20.48 18.1,19.85 19.52,19.85 29.52,29.84 33.66,29.84 34.66,30.85 IC1.4
MCU_D6
  Top 0.254: IC1.6 29.58,29.27 19.68,19.37 17.46,19.37 16.69,20.15 IC2.31
MCU_D7
  Top 0.254: IC1.7 29.43,28.49 19.84,18.9 16.66,18.9 15.88,19.68 15.88,21.49 IC2.30
MCU_LED  (via drill 0.6)
  Top 0.406: IC2.16 10.95,28.11 v11.11,27.94 | v11.11,36.51 11.11,49.53 13.34,51.75 R7.1
  Bottom 0.406: v11.11,27.94 v11.11,36.51
MCU_MISO  (via drill 0.6)
  Top 0.254: IC2.2 17.49,34 17.93,34.44 23.18,34.44 25.41,36.67 v25.41,38.1
  Bottom 0.254: v25.41,38.1 24.46,39.05 24.46,43.65 J2.1
MCU_MOSI
  Top 0.254: IC2.1 18.29,33.84 18.41,33.97 24.14,33.97 | 24.14,33.97 26.36,36.2 26.36,38.42 27,39.05 27,41.27 J2.4 | IC1.58 42,37.09 40.19,38.9 38.9,38.9 37.45,37.45 35.53,37.45 32.04,33.97 24.14,33.97
MCU_OE  (via drill 0.6)
  Top 0.254: 9.5,30.5 IC2.13 8.51,30.48 12.7,30.48 v13.02,30.16 | IC1.62 38.85,37.03 v38.73,37.15
  Bottom 0.254: v38.73,37.15 38.1,36.51 22.23,36.51 14.92,29.21 13.97,29.21 v13.02,30.16
MCU_RESET
  Top 0.254: IC2.4 15.89,34.3 16.98,35.39 21.27,35.39 21.91,36.03 21.91,36.98 | 21.91,37.46 R1.2 21.91,36.98 | J2.5 22.23,39.05 21.91,38.73 21.91,37.46 | 21.91,36.98 21.91,37.46
MCU_RW  (via drill 0.6)
  Top 0.254: IC2.12 13.14,31.3 v14.29,30.16 | v39.69,38.1 39.69,35.12 IC1.61
  Bottom 0.254: v14.29,30.16 14.92,30.16 21.91,37.15 37.47,37.15 38.42,38.1 v39.69,38.1
MCU_SCK
  Top 0.254: IC2.3 16.69,34.15 17.45,34.92 22.55,34.92 24.46,36.83 24.46,41.44 J2.3
MCU_VUSB+
  Top 0.254: R4.1 5.71,52.7 8.89,49.53 8.89,35.24 10.29,33.84 IC2.11
MCU_VUSB-
  Top 0.254: R5.1 10.79,51.12 10.16,50.48 10.16,35.88 11.89,34.15 IC2.9
MCU_VUSB-2
  Top 0.254: IC2.10 11.09,34 9.53,35.56 9.53,50.48 8.26,51.75 R6.1
N$1
  Top 0.254: Q2.1 6.98,41.91 7.3,41.59 R3.1
N$3
  Top 0.254: IC2.7 13.49,34.77 13.34,34.92 13.34,38.1 13.81,38.57 16.18,38.57 17.65,40.04 Y1.2 17.84,41.18 17.84,44.7 C5.2
N$4  (via drill 0.6)
  Top 0.254: IDT_20.1 24.76,15.11 v26.52,15.11 | v34.72,18.16 36.01,18.16 36.33,17.84 40.05,17.84 SJ1.2 40.42,17.95 IC1.21 IC1.20
  Bottom 0.254: v26.52,15.11 30.22,15.11 33.27,18.16 v34.72,18.16
N$5
  Top 0.254: IC2.8 12.7,33.12 12.7,40.86 Y1.1 12.23,41.33 C6.1 12.25,45.15
N$8
  Top 0.406: R7.2 13.34,57.47 14.29,58.42 LED1.A
VBUS
  Top 0.61: J1.VBUS 7.61,70.09 D1.2
VCC  (2 unrouted)
  Top 0.254: R8.2 24.92,19.61 24.43,20.09 23.47,20.09 23.37,20.19 | SJ1.1 40.19,15.52 C1.1
  Top 0.305: C2.1
  Top 0.406: 50.86,26.99 IC1.40 51.83,26.91 52.39,26.35 C2.1 | 42.86,35.14 IC1.57 | 7.62,5.66 P1.3 P1.2 | IC2.5 15.09,34.77 16.19,35.88 16.51,36.19 C8.1 | IC2.38 15.07,26.5 | C2.1 | IC1.57 42.79,38.18 42.55,38.42 C3.1 | 12.38,14.29 13.97,15.88 13.97,18.09 C9.1 13.97,18.73 13.97,20 13.49,20.48 IC2.27 13.49,24.92 14.29,25.72 | IC2.17 C7.1 | R2.2 2.23,37.15 2.22,37.15 | 15.07,26.5 14.29,25.72 | IC1.13 36.46,23.76 36.83,24.13 36.83,27.3 36.44,27.7 IC1.8 30.87,27.7 30.8,27.62 30.8,26.07 C4.1 | J2.2 25.73,46.99 24.14,48.58 | IC1.57 42.79,33.9 42.55,33.66 40.64,33.66 40.42,33.87 IC1.60 | 8.89,27.3 10.16,27.3 11.11,26.35 13.65,26.35 14.29,25.72 | 15.07,26.5 15.24,26.67 15.24,31.95 15.11,32.08 | 40.42,15.28 C1.1 | 5V.1 8.1,12.7 7.62,12.22
  Top 0.61: 55.88,26.99 55.24,26.35 C2.1 | 53.66,14.61 40.78,14.61 40.32,14.9 40.48,15.38 C1.1 | C3.1 42.55,40.95 42.23,41.27 | C7.1 2.22,27.3 | 30.8,27.62 23.37,20.19 17.46,14.29 | D1.1 1.91,63.82 2.22,63.18 | C8.1 16.83,36.83 17.46,36.98 R1.1 | 19.68,38.1 19.68,47.62 18.73,48.58
  Top 0.813: 7.62,14.29 12.38,14.29 17.46,14.29 | C10.2 16.82,65.72 17.46,65.72
  Top 1.27: 53.66,14.61 55.88,16.83 55.88,26.99 55.88,40.01 54.61,41.27 42.23,41.27 35.88,41.27 33.66,43.5 33.66,46.04 31.11,48.58 24.14,48.58 18.73,48.58 17.46,49.85 17.46,65.72 17.46,67.62 17.46,68.9 16.69,69.67 16.68,69.67 | 16.68,69.67 12.06,73.98 6.99,73.98 6.35,73.34 2.22,68.9 2.22,63.18 2.22,37.15 2.22,27.3 2.22,14.92 2.86,14.29 7.62,14.29 7.62,12.22 7.62,5.66 | 16.68,69.67 16.83,69.53
(copper drawn outside any net)
  shapes: Top area x3

### Text on the board
tPlace: 16k ->
tNames: C64 USB Flash Cart | v1.0 RC2 | PB6 | VCC | PB7 | PB5 | RST | GND